# Altium project CM4_Home_Controller.PrjPcb (part 1 of 2)
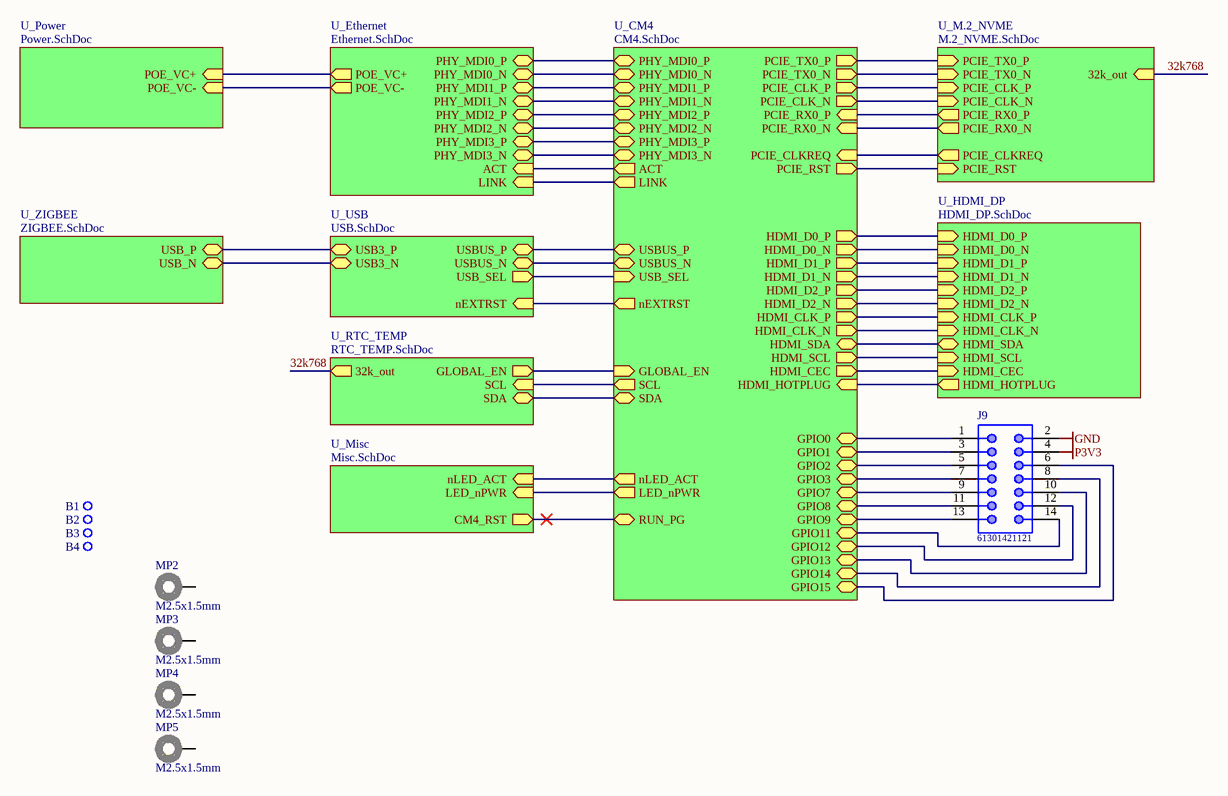
[diagram p0: CM4_Home_Controller.SchDoc]
10 sheets, 134 parts. Net scope: hierarchical (ports join the sheet entries above them; power ports are global).
Board file: CM4_Home_Controller.PcbDoc
Sheets:
  CM4_Home_Controller.SchDoc
    U_CM4 = CM4.SchDoc
    U_M.2_NVME = M.2_NVME.SchDoc
    U_Power = Power.SchDoc
    U_Ethernet = Ethernet.SchDoc
    U_USB = USB.SchDoc
    U_HDMI_DP = HDMI_DP.SchDoc
    U_RTC_TEMP = RTC_TEMP.SchDoc
    U_ZIGBEE = ZIGBEE.SchDoc
    U_Misc = Misc.SchDoc

## Sheet CM4_Home_Controller.SchDoc
size A4; SheetNumber: 1; SheetTotal: 10

### Parts
B1  Plated Hole  [MTG300_600]  (value not drawn)  (no BOM)
B2  Plated Hole  [MTG300_600]  (value not drawn)  (no BOM)
B3  Plated Hole  [MTG300_600]  (value not drawn)  (no BOM)
B4  Plated Hole  [MTG300_600]  (value not drawn)  (no BOM)
J9  61301421121  [61301421121]
MP2  M2.5x1.5mm  [9774015151]
MP3  M2.5x1.5mm  [9774015151]
MP4  M2.5x1.5mm  [9774015151]
MP5  M2.5x1.5mm  [9774015151]

### Sub-sheets
U_CM4 = CM4.SchDoc: PCIE_RX0_N (in), PCIE_RX0_P (in), PCIE_TX0_N (out), PCIE_TX0_P (out), PCIE_CLK_P (out), PCIE_CLK_N (out), PCIE_RST (out), PCIE_CLKREQ (in), PHY_MDI0_P (bidir), LINK (out), ACT (out), PHY_MDI3_N (bidir), PHY_MDI3_P (bidir), PHY_MDI2_N (bidir), PHY_MDI2_P (bidir), PHY_MDI1_N (bidir), PHY_MDI1_P (bidir), PHY_MDI0_N (bidir), USBUS_P (bidir), USBUS_N (bidir), HDMI_D0_P (out), HDMI_D0_N (out), HDMI_D1_P (out), HDMI_D1_N (out), HDMI_D2_P (out), HDMI_D2_N (out), HDMI_CLK_P (out), HDMI_CLK_N (out), HDMI_SDA (bidir), HDMI_SCL (out), HDMI_CEC (out), HDMI_HOTPLUG (in), GLOBAL_EN (in), SDA (bidir), nEXTRST (out), nLED_ACT (out), LED_nPWR (out), USB_SEL (in), SCL (out), RUN_PG (bidir), GPIO0 (bidir), GPIO12 (bidir), GPIO1 (bidir), GPIO14 (bidir), GPIO3 (bidir), GPIO11 (bidir), GPIO9 (bidir), GPIO2 (bidir), GPIO15 (bidir), GPIO13 (bidir), GPIO8 (bidir), GPIO7 (bidir)
U_Ethernet = Ethernet.SchDoc: PHY_MDI0_P (bidir), PHY_MDI0_N (bidir), PHY_MDI1_P (bidir), PHY_MDI1_N (bidir), PHY_MDI2_P (bidir), PHY_MDI2_N (bidir), PHY_MDI3_P (bidir), PHY_MDI3_N (bidir), ACT (in), LINK (in), POE_VC+ (out), POE_VC- (out)
U_HDMI_DP = HDMI_DP.SchDoc: HDMI_D1_P (in), HDMI_SCL (in), HDMI_D1_N (in), HDMI_CEC (in), HDMI_CLK_N (in), HDMI_HOTPLUG (out), HDMI_CLK_P (in), HDMI_SDA (bidir), HDMI_D2_N (in), HDMI_D0_P (in), HDMI_D0_N (in), HDMI_D2_P (in)
U_M.2_NVME = M.2_NVME.SchDoc: PCIE_RX0_N (out), PCIE_RX0_P (out), PCIE_TX0_N (in), PCIE_TX0_P (in), PCIE_CLK_P (in), PCIE_CLK_N (in), PCIE_RST (in), PCIE_CLKREQ (out), 32k_out (in)
U_Misc = Misc.SchDoc: nLED_ACT (in), LED_nPWR (in), CM4_RST (out)
U_Power = Power.SchDoc: POE_VC+ (in), POE_VC- (in)
U_RTC_TEMP = RTC_TEMP.SchDoc: 32k_out (out), GLOBAL_EN (out), SCL (in), SDA (bidir)
U_USB = USB.SchDoc: USBUS_P (bidir), USBUS_N (bidir), USB3_N (bidir), USB3_P (bidir), nEXTRST (in), USB_SEL (out)
U_ZIGBEE = ZIGBEE.SchDoc: USB_P (bidir), USB_N (bidir)

### Nets
GND: J9.2
P3V3: J9.4
32k768: sheet U_M.2_NVME/32k_out, sheet U_RTC_TEMP/32k_out
ACT: sheet U_CM4/ACT, sheet U_Ethernet/ACT
CM4_RST: sheet U_CM4/RUN_PG, sheet U_Misc/CM4_RST
GLOBAL_EN: sheet U_CM4/GLOBAL_EN, sheet U_RTC_TEMP/GLOBAL_EN
HDMI_CEC: sheet U_CM4/HDMI_CEC, sheet U_HDMI_DP/HDMI_CEC
HDMI_CLK_N: sheet U_CM4/HDMI_CLK_N, sheet U_HDMI_DP/HDMI_CLK_N
HDMI_CLK_P: sheet U_CM4/HDMI_CLK_P, sheet U_HDMI_DP/HDMI_CLK_P
HDMI_D0_N: sheet U_CM4/HDMI_D0_N, sheet U_HDMI_DP/HDMI_D0_N
HDMI_D0_P: sheet U_CM4/HDMI_D0_P, sheet U_HDMI_DP/HDMI_D0_P
HDMI_D1_N: sheet U_CM4/HDMI_D1_N, sheet U_HDMI_DP/HDMI_D1_N
HDMI_D1_P: sheet U_CM4/HDMI_D1_P, sheet U_HDMI_DP/HDMI_D1_P
HDMI_D2_N: sheet U_CM4/HDMI_D2_N, sheet U_HDMI_DP/HDMI_D2_N
HDMI_D2_P: sheet U_CM4/HDMI_D2_P, sheet U_HDMI_DP/HDMI_D2_P
HDMI_HOTPLUG: sheet U_CM4/HDMI_HOTPLUG, sheet U_HDMI_DP/HDMI_HOTPLUG
HDMI_SCL: sheet U_CM4/HDMI_SCL, sheet U_HDMI_DP/HDMI_SCL
HDMI_SDA: sheet U_CM4/HDMI_SDA, sheet U_HDMI_DP/HDMI_SDA
LED_nPWR: sheet U_CM4/LED_nPWR, sheet U_Misc/LED_nPWR
LINK: sheet U_CM4/LINK, sheet U_Ethernet/LINK
MDI0_N: sheet U_CM4/PHY_MDI0_N, sheet U_Ethernet/PHY_MDI0_N
MDI0_P: sheet U_CM4/PHY_MDI0_P, sheet U_Ethernet/PHY_MDI0_P
MDI1_N: sheet U_CM4/PHY_MDI1_N, sheet U_Ethernet/PHY_MDI1_N
MDI1_P: sheet U_CM4/PHY_MDI1_P, sheet U_Ethernet/PHY_MDI1_P
MDI2_N: sheet U_CM4/PHY_MDI2_N, sheet U_Ethernet/PHY_MDI2_N
MDI2_P: sheet U_CM4/PHY_MDI2_P, sheet U_Ethernet/PHY_MDI2_P
MDI3_N: sheet U_CM4/PHY_MDI3_N, sheet U_Ethernet/PHY_MDI3_N
MDI3_P: sheet U_CM4/PHY_MDI3_P, sheet U_Ethernet/PHY_MDI3_P
nEXTRST: sheet U_CM4/nEXTRST, sheet U_USB/nEXTRST
nLED_ACT: sheet U_CM4/nLED_ACT, sheet U_Misc/nLED_ACT
PCIE_CLK_N: sheet U_CM4/PCIE_CLK_N, sheet U_M.2_NVME/PCIE_CLK_N
PCIE_CLK_P: sheet U_CM4/PCIE_CLK_P, sheet U_M.2_NVME/PCIE_CLK_P
PCIE_CLKREQ: sheet U_CM4/PCIE_CLKREQ, sheet U_M.2_NVME/PCIE_CLKREQ
PCIE_RST: sheet U_CM4/PCIE_RST, sheet U_M.2_NVME/PCIE_RST
PCIE_RX0_N: sheet U_CM4/PCIE_RX0_N, sheet U_M.2_NVME/PCIE_RX0_N
PCIE_RX0_P: sheet U_CM4/PCIE_RX0_P, sheet U_M.2_NVME/PCIE_RX0_P
PCIE_TX0_N: sheet U_CM4/PCIE_TX0_N, sheet U_M.2_NVME/PCIE_TX0_N
PCIE_TX0_P: sheet U_CM4/PCIE_TX0_P, sheet U_M.2_NVME/PCIE_TX0_P
SCL: sheet U_CM4/SCL, sheet U_RTC_TEMP/SCL
SDA: sheet U_CM4/SDA, sheet U_RTC_TEMP/SDA
USB3_N: sheet U_USB/USB3_N, sheet U_ZIGBEE/USB_N
USB3_P: sheet U_USB/USB3_P, sheet U_ZIGBEE/USB_P
USB_SEL: sheet U_CM4/USB_SEL, sheet U_USB/USB_SEL
USBUS_N: sheet U_CM4/USBUS_N, sheet U_USB/USBUS_N
USBUS_P: sheet U_CM4/USBUS_P, sheet U_USB/USBUS_P
NetCM1_28: J9.10 ; sheet U_CM4/GPIO13
NetCM1_31: J9.12 ; sheet U_CM4/GPIO12
NetCM1_35: J9.3 ; sheet U_CM4/GPIO1
NetCM1_36: J9.1 ; sheet U_CM4/GPIO0
NetCM1_37: J9.9 ; sheet U_CM4/GPIO7
NetCM1_38: J9.14 ; sheet U_CM4/GPIO11
NetCM1_39: J9.11 ; sheet U_CM4/GPIO8
NetCM1_40: J9.13 ; sheet U_CM4/GPIO9
NetCM1_51: J9.6 ; sheet U_CM4/GPIO15
NetCM1_55: J9.8 ; sheet U_CM4/GPIO14
NetCM1_56: J9.7 ; sheet U_CM4/GPIO3
NetCM1_58: J9.5 ; sheet U_CM4/GPIO2
NetD3#2_3: sheet U_Power/POE_VC+, sheet U_Ethernet/POE_VC+
NetD3#2_4: sheet U_Power/POE_VC-, sheet U_Ethernet/POE_VC-

Not connected (* = marked no-connect by the designer): B1 1; B2 1; B3 1; B4 1; MP2 1; MP3 1; MP4 1; MP5 1

### Library data of the parts
B1-B4 = PLATED_HOLE3.0_PAD6.0: Single Terminal Socket; Part Description: Plated Through Hole: Hole Dia.=3.0mm Pad Dia.=6.0mm; Mounted: No; Part Number: PLATED_HOLE3.0_PAD6.0; Component Type: Standard (No BOM); Pin Count: 1; Family: Plated Hole; Socket: No; SMD: No; Sense: No; Status: None; ComponentHeight: 0mm; HelpURL: Undefined; Author: CERN DEM JLC; CreateDate: 26.05.2008; LatestRevisionDate: 26.05.2008; PackageDescription: Plated Through Hole: Hole Dia.=3.0mm Pad Dia.=6.0mm
J9 = 61301421121: WR-PHD Pin Header, THT, pitch 2.54mm, Dual Row, Vertical, 14pin; Pin Number: 14; Gender: Male; Rated Current: 3A; Working Voltage: 250VAC; Withstanding Voltage: 500VAC; Contact Resistance: 20mOhm; ComponentLink1Description: Manufacturer; ComponentLink1URL: http://www.we-online.de; ComponentLink2Description: Datasheet; ComponentLink2URL: https://katalog.we-online.de/em/datasheet/6130xx21121.pdf; Part Number: 61301421121; Published Date: June 2019; Publisher: Wurth Elektronik; Pitch: 2.54mm; Operating Temperature: -40 to +105degC; Mounting Technology: THT; Packaging: Bag; Row Number: Dual; Orientation: Vertical
MP2-MP5 = 9774015151: WA-SMSI SMT Steel Spacer, internal Thread, OD 5.1mm, M2.5x1.5mm; Manufacturer: Wurth Elektronik; Inner Diameter: 3.5mm; Surface: Tin; Thread: M2.5; ComponentLink1Description: Manufacturer; ComponentLink1URL: http://www.we-online.de; ComponentLink2Description: Datasheet; ComponentLink2URL: https://www.we-online.com/catalog/datasheet/9774015151.pdf; Mounting Technology: SMT; Packaging: Bulk; Manufacturer Part Number: 9774015151; Length: 1.5mm; Inner Thread Length: -; Operating Temperature: -55 to +150degC; Outer Diameter: 5.1mm; Published Date: April 2020; Material: Steel

## Sheet CM4.SchDoc
size A3; SheetNumber: 3; SheetTotal: 10
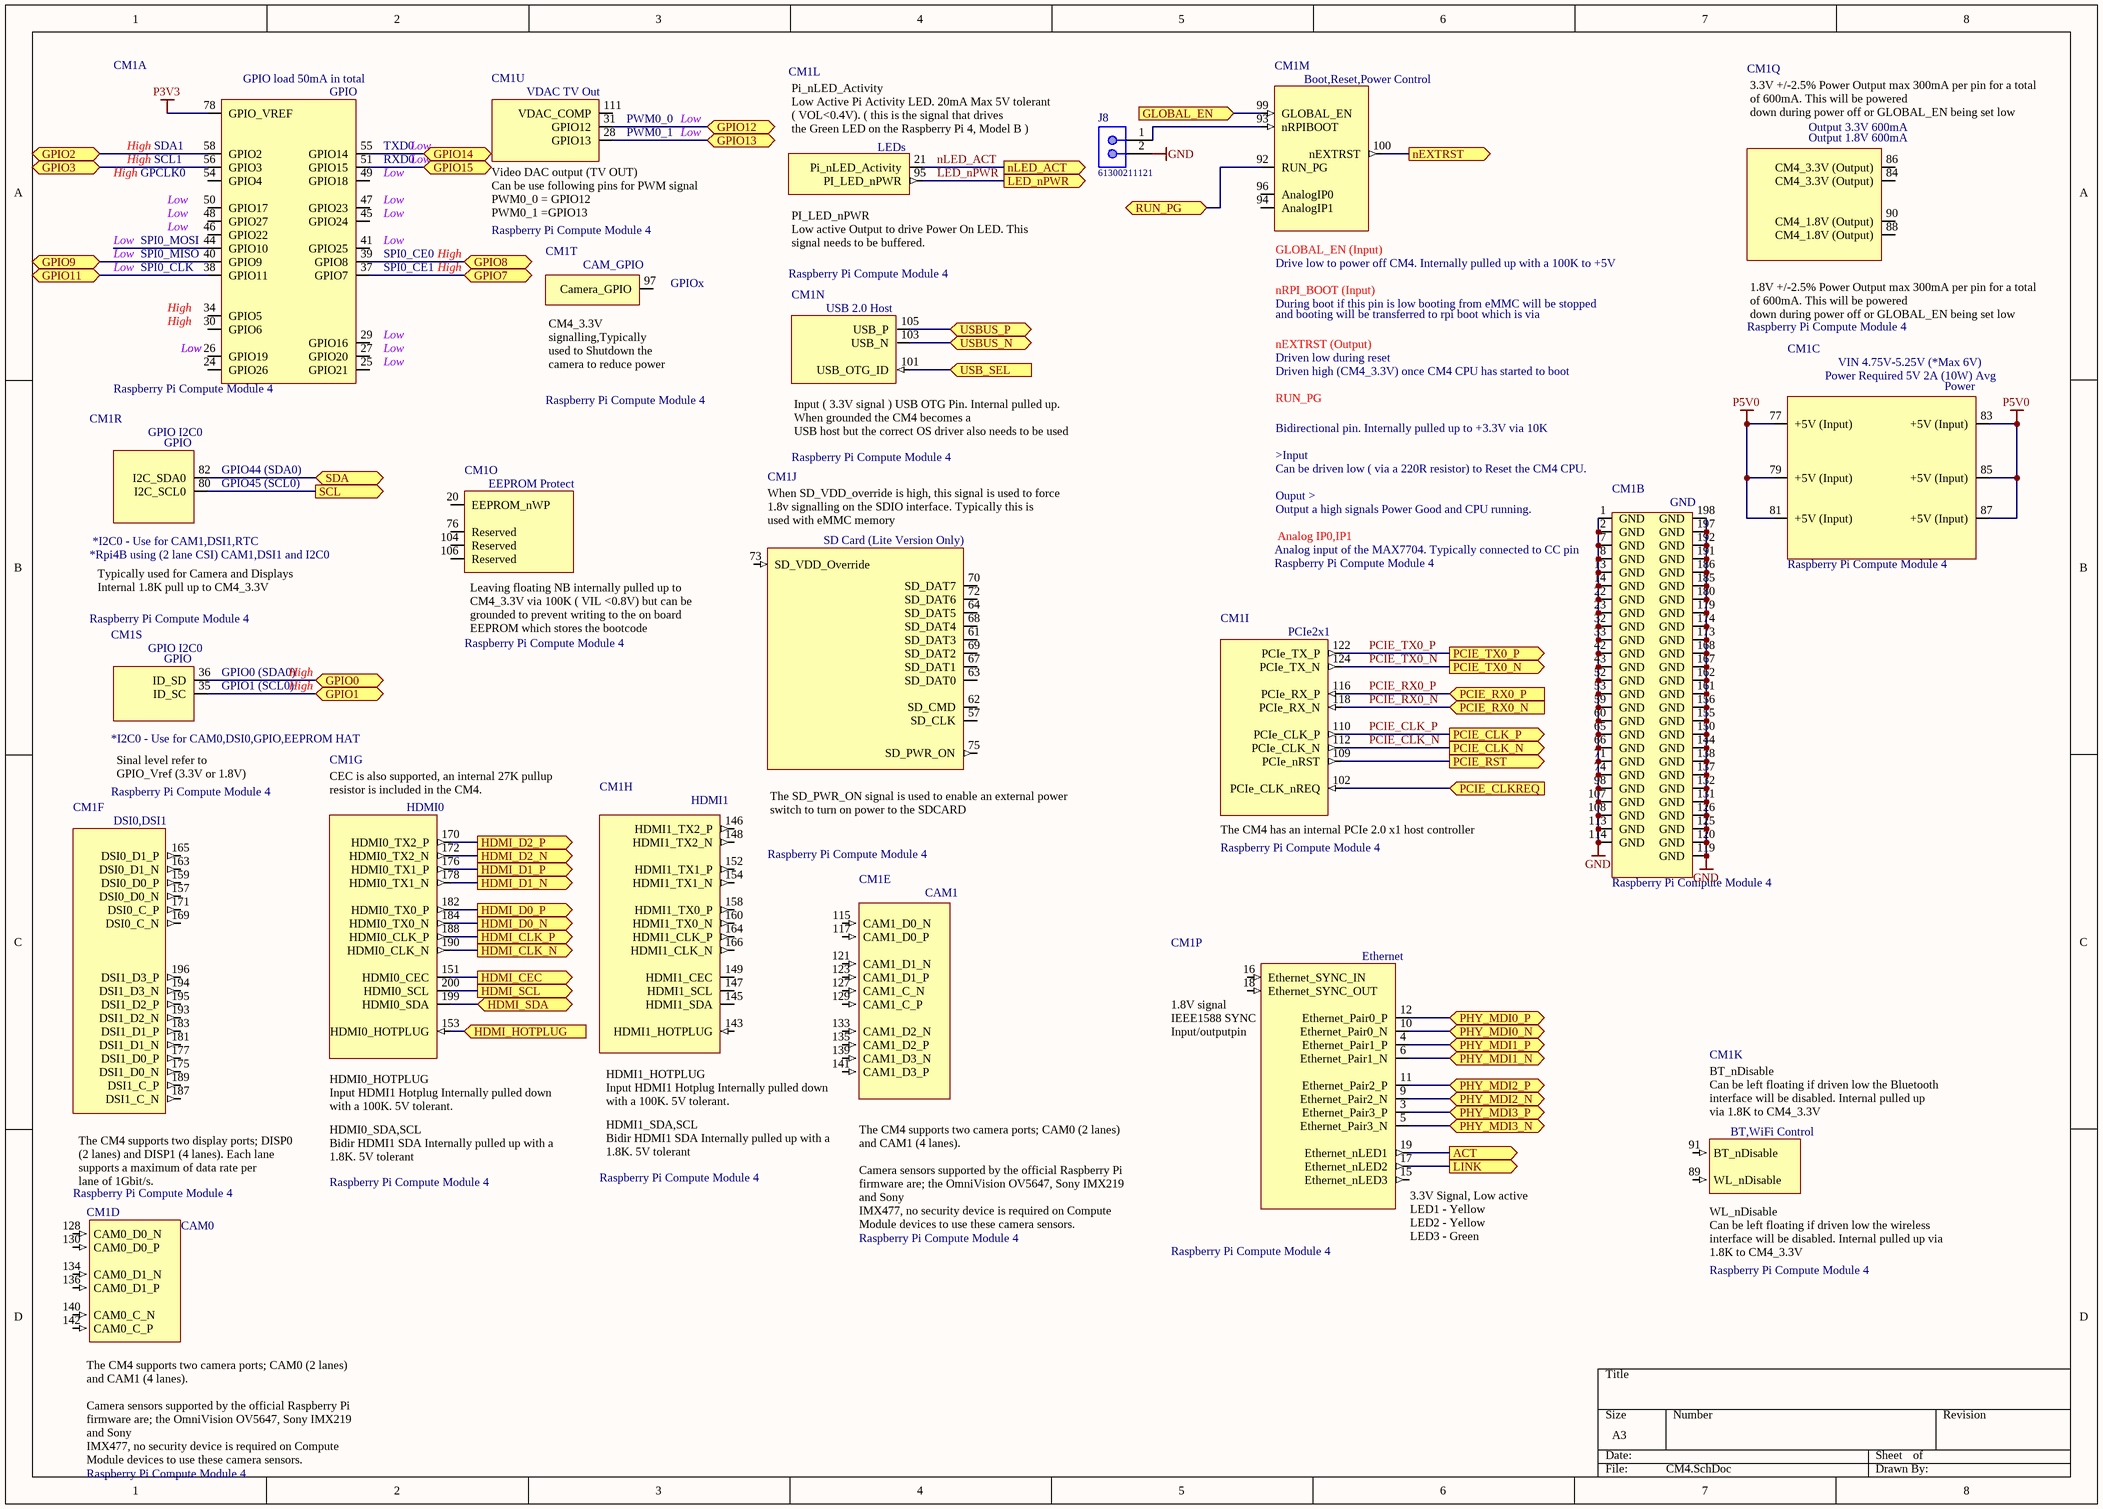
[diagram p1: CM4.SchDoc]

### Parts
CM1  Raspberry Pi Compute Module 4  [CM4-DF40HC(3.0)-100DS-0.4v_3mm_1.5mm]  (parts A,B,C,D,E,F,G,H,I,J,K,L,M,N,O,P,Q,R,S,T,U of 21)  (no BOM)
J8  61300211121  [61300211121]

### Ports
ACT (out), GLOBAL_EN (in), GPIO0 (bidir), GPIO1 (bidir), GPIO2 (bidir), GPIO3 (bidir), GPIO7 (bidir), GPIO8 (bidir), GPIO9 (bidir), GPIO11 (bidir), GPIO12 (bidir), GPIO13 (bidir), GPIO14 (bidir), GPIO15 (bidir), HDMI_CEC (out), HDMI_CLK_N (out), HDMI_CLK_P (out), HDMI_D0_N (out), HDMI_D0_P (out), HDMI_D1_N (out), HDMI_D1_P (out), HDMI_D2_N (out), HDMI_D2_P (out), HDMI_HOTPLUG (in), HDMI_SCL (out), HDMI_SDA (bidir), LED_nPWR (out), LINK (out), nEXTRST (out), nLED_ACT (out), PCIE_CLK_N (out), PCIE_CLK_P (out), PCIE_CLKREQ (in), PCIE_RST (out), PCIE_RX0_N (in), PCIE_RX0_P (in), PCIE_TX0_N (out), PCIE_TX0_P (out), PHY_MDI0_N (bidir), PHY_MDI0_P (bidir), PHY_MDI1_N (bidir), PHY_MDI1_P (bidir), PHY_MDI2_N (bidir), PHY_MDI2_P (bidir), PHY_MDI3_N (bidir), PHY_MDI3_P (bidir), RUN_PG (bidir), SCL (out), SDA (bidir), USB_SEL (in), USBUS_N (bidir), USBUS_P (bidir)

### Nets
GND: CM1.1(GND) CM1.2(GND) CM1.7(GND) CM1.8(GND) CM1.13(GND) CM1.14(GND) CM1.22(GND) CM1.23(GND) CM1.32(GND) CM1.33(GND) CM1.42(GND) CM1.43(GND) CM1.52(GND) CM1.53(GND) CM1.59(GND) CM1.60(GND) CM1.65(GND) CM1.66(GND) CM1.71(GND) CM1.74(GND) CM1.98(GND) CM1.107(GND) CM1.108(GND) CM1.113(GND) CM1.114(GND) CM1.119(GND) CM1.120(GND) CM1.125(GND) CM1.126(GND) CM1.131(GND) CM1.132(GND) CM1.137(GND) CM1.138(GND) CM1.144(GND) CM1.150(GND) CM1.155(GND) CM1.156(GND) CM1.161(GND) CM1.162(GND) CM1.167(GND) CM1.168(GND) CM1.173(GND) CM1.174(GND) CM1.179(GND) CM1.180(GND) CM1.185(GND) CM1.186(GND) CM1.191(GND) CM1.192(GND) CM1.197(GND) CM1.198(GND) J8.2
P3V3: CM1.78(GPIO_VREF)
P5V0: CM1.77(+5V_(Input)) CM1.79(+5V_(Input)) CM1.81(+5V_(Input)) CM1.83(+5V_(Input)) CM1.85(+5V_(Input)) CM1.87(+5V_(Input))
ACT: CM1.19(Ethernet_nLED1) ; port ACT
CM4_RST: CM1.92(RUN_PG) ; port RUN_PG
GLOBAL_EN: CM1.99(GLOBAL_EN) ; port GLOBAL_EN
HDMI_CEC: CM1.151(HDMI0_CEC) ; port HDMI_CEC
HDMI_CLK_N: CM1.190(HDMI0_CLK_N) ; port HDMI_CLK_N
HDMI_CLK_P: CM1.188(HDMI0_CLK_P) ; port HDMI_CLK_P
HDMI_D0_N: CM1.184(HDMI0_TX0_N) ; port HDMI_D0_N
HDMI_D0_P: CM1.182(HDMI0_TX0_P) ; port HDMI_D0_P
HDMI_D1_N: CM1.178(HDMI0_TX1_N) ; port HDMI_D1_N
HDMI_D1_P: CM1.176(HDMI0_TX1_P) ; port HDMI_D1_P
HDMI_D2_N: CM1.172(HDMI0_TX2_N) ; port HDMI_D2_N
HDMI_D2_P: CM1.170(HDMI0_TX2_P) ; port HDMI_D2_P
HDMI_HOTPLUG: CM1.153(HDMI0_HOTPLUG) ; port HDMI_HOTPLUG
HDMI_SCL: CM1.200(HDMI0_SCL) ; port HDMI_SCL
HDMI_SDA: CM1.199(HDMI0_SDA) ; port HDMI_SDA
LED_nPWR: CM1.95(PI_LED_nPWR) ; port LED_nPWR
LINK: CM1.17(Ethernet_nLED2) ; port LINK
MDI0_N: CM1.10(Ethernet_Pair0_N) ; port PHY_MDI0_N
MDI0_P: CM1.12(Ethernet_Pair0_P) ; port PHY_MDI0_P
MDI1_N: CM1.6(Ethernet_Pair1_N) ; port PHY_MDI1_N
MDI1_P: CM1.4(Ethernet_Pair1_P) ; port PHY_MDI1_P
MDI2_N: CM1.9(Ethernet_Pair2_N) ; port PHY_MDI2_N
MDI2_P: CM1.11(Ethernet_Pair2_P) ; port PHY_MDI2_P
MDI3_N: CM1.5(Ethernet_Pair3_N) ; port PHY_MDI3_N
MDI3_P: CM1.3(Ethernet_Pair3_P) ; port PHY_MDI3_P
nEXTRST: CM1.100(nEXTRST) ; port nEXTRST
nLED_ACT: CM1.21(Pi_nLED_Activity) ; port nLED_ACT
PCIE_CLK_N: CM1.112(PCIe_CLK_N) ; port PCIE_CLK_N
PCIE_CLK_P: CM1.110(PCIe_CLK_P) ; port PCIE_CLK_P
PCIE_CLKREQ: CM1.102(PCIe_CLK_nREQ) ; port PCIE_CLKREQ
PCIE_RST: CM1.109(PCIe_nRST) ; port PCIE_RST
PCIE_RX0_N: CM1.118(PCIe_RX_N) ; port PCIE_RX0_N
PCIE_RX0_P: CM1.116(PCIe_RX_P) ; port PCIE_RX0_P
PCIE_TX0_N: CM1.124(PCIe_TX_N) ; port PCIE_TX0_N
PCIE_TX0_P: CM1.122(PCIe_TX_P) ; port PCIE_TX0_P
SCL: CM1.80(I2C_SCL0) ; port SCL
SDA: CM1.82(I2C_SDA0) ; port SDA
USB_SEL: CM1.101(USB_OTG_ID) ; port USB_SEL
USBUS_N: CM1.103(USB_N) ; port USBUS_N
USBUS_P: CM1.105(USB_P) ; port USBUS_P
NetCM1_28: CM1.28(GPIO13) ; port GPIO13
NetCM1_31: CM1.31(GPIO12) ; port GPIO12
NetCM1_35: CM1.35(ID_SC) ; port GPIO1
NetCM1_36: CM1.36(ID_SD) ; port GPIO0
NetCM1_37: CM1.37(GPIO7) ; port GPIO7
NetCM1_38: CM1.38(GPIO11) ; port GPIO11
NetCM1_39: CM1.39(GPIO8) ; port GPIO8
NetCM1_40: CM1.40(GPIO9) ; port GPIO9
NetCM1_51: CM1.51(GPIO15) ; port GPIO15
NetCM1_55: CM1.55(GPIO14) ; port GPIO14
NetCM1_56: CM1.56(GPIO3) ; port GPIO3
NetCM1_58: CM1.58(GPIO2) ; port GPIO2
NetCM1_93: CM1.93(nRPIBOOT) J8.1

Not connected (* = marked no-connect by the designer): CM1 15(Ethernet_nLED3) 16(Ethernet_SYNC_IN) 18(Ethernet_SYNC_OUT) 20(EEPROM_nWP) 24(GPIO26) 25(GPIO21) 26(GPIO19) 27(GPIO20) 29(GPIO16) 30(GPIO6) 34(GPIO5) 41(GPIO25) 44(GPIO10) 45(GPIO24) 46(GPIO22) 47(GPIO23) 48(GPIO27) 49(GPIO18) 50(GPIO17) 54(GPIO4) 57(SD_CLK) 61(SD_DAT3) 62(SD_CMD) 63(SD_DAT0) 64(SD_DAT5) 67(SD_DAT1) 68(SD_DAT4) 69(SD_DAT2) 70(SD_DAT7) 72(SD_DAT6) 73(SD_VDD_Override) 75(SD_PWR_ON) 76(Reserved) 84(CM4_3.3V_(Output)) 86(CM4_3.3V_(Output)) 88(CM4_1.8V_(Output)) 89(WL_nDisable) 90(CM4_1.8V_(Output)) 91(BT_nDisable) 94(AnalogIP1) 96(AnalogIP0) 97(Camera_GPIO) 104(Reserved) 106(Reserved) 111(VDAC_COMP) 115(CAM1_D0_N) 117(CAM1_D0_P) 121(CAM1_D1_N) 123(CAM1_D1_P) 127(CAM1_C_N) 128(CAM0_D0_N) 129(CAM1_C_P) 130(CAM0_D0_P) 133(CAM1_D2_N) 134(CAM0_D1_N) 135(CAM1_D2_P) 136(CAM0_D1_P) 139(CAM1_D3_N) 140(CAM0_C_N) 141(CAM1_D3_P) 142(CAM0_C_P) 143(HDMI1_HOTPLUG) 145(HDMI1_SDA) 146(HDMI1_TX2_P) 147(HDMI1_SCL) 148(HDMI1_TX2_N) 149(HDMI1_CEC) 152(HDMI1_TX1_P) 154(HDMI1_TX1_N) 157(DSI0_D0_N) 158(HDMI1_TX0_P) 159(DSI0_D0_P) 160(HDMI1_TX0_N) 163(DSI0_D1_N) 164(HDMI1_CLK_P) 165(DSI0_D1_P) 166(HDMI1_CLK_N) 169(DSI0_C_N) 171(DSI0_C_P) 175(DSI1_D0_N) 177(DSI1_D0_P) 181(DSI1_D1_N) 183(DSI1_D1_P) 187(DSI1_C_N) 189(DSI1_C_P) 193(DSI1_D2_N) 194(DSI1_D3_N) 195(DSI1_D2_P) 196(DSI1_D3_P)

### Notes on the sheet
- (in symbol CM4, part A) GPIO load 50mA in total; GPIO; High; SDA1; TXD0; Low; SCL1; RXD0; GPCLK0; SPI0_MOSI; SPI0_MISO; SPI0_CE0; SPI0_CLK; SPI0_CE1; by Amornthep Phunsin
- (in symbol CM4, part C) VIN 4.75V-5.25V (*Max 6V); Power Required 5V 2A (10W) Avg; Power; by Amornthep Phunsin
- (in symbol CM4, part D) CAM0; The CM4 supports two camera ports; CAM0 (2 lanes) and CAM1 (4 lanes). / Camera sensors supported by the official Raspberry Pi firmware are; the OmniVision OV5647, Sony IMX219 and Sony / IMX477, no security device is required on Compute Module devices to use these camera sensors.
- (in symbol CM4, part E) CAM1; The CM4 supports two camera ports; CAM0 (2 lanes) and CAM1 (4 lanes). / Camera sensors supported by the official Raspberry Pi firmware are; the OmniVision OV5647, Sony IMX219 and Sony / IMX477, no security device is required on Compute Module devices to use these camera sensors.
- (in symbol CM4, part F) DSI0,DSI1; The CM4 supports two display ports; DISP0 (2 lanes) and DISP1 (4 lanes). Each lane supports a maximum of data rate per / lane of 1Gbit/s.
- (in symbol CM4, part G) HDMI0; CEC is also supported, an internal 27K pullup resistor is included in the CM4.; HDMI0_HOTPLUG / Input HDMI1 Hotplug Internally pulled down with a 100K. 5V tolerant.; HDMI0_SDA,SCL / Bidir HDMI1 SDA Internally pulled up with a 1.8K. 5V tolerant
- (in symbol CM4, part H) HDMI1; HDMI1_HOTPLUG / Input HDMI1 Hotplug Internally pulled down with a 100K. 5V tolerant.; HDMI1_SDA,SCL / Bidir HDMI1 SDA Internally pulled up with a 1.8K. 5V tolerant
- (in symbol CM4, part I) PCIe2x1; The CM4 has an internal PCIe 2.0 x1 host controller
- (in symbol CM4, part J) When SD_VDD_override is high, this signal is used to force 1.8v signalling on the SDIO interface. Typically this is / used with eMMC memory; SD Card (Lite Version Only); by Amornthep Phunsin; The SD_PWR_ON signal is used to enable an external power switch to turn on power to the SDCARD
- (in symbol CM4, part K) BT_nDisable / Can be left floating if driven low the Bluetooth interface will be disabled. Internal pulled up / via 1.8K to CM4_3.3V; BT,WiFi Control; WL_nDisable / Can be left floating if driven low the wireless interface will be disabled. Internal pulled up via / 1.8K to CM4_3.3V
- (in symbol CM4, part L) Pi_nLED_Activity / Low Active Pi Activity LED. 20mA Max 5V tolerant ( VOL<0.4V). ( this is the signal that drives / the Green LED on the Raspberry Pi 4, Model B ); LEDs; PI_LED_nPWR / Low active Output to drive Power On LED. This signal needs to be buffered.
- (in symbol CM4, part M) Boot,Reset,Power Control; GLOBAL_EN (Input); Drive low to power off CM4. Internally pulled up with a 100K to +5V; nRPI_BOOT (Input); During boot if this pin is low booting from eMMC will be stopped; and booting will be transferred to rpi boot which is via; nEXTRST (Output); Driven low during reset; Driven high (CM4_3.3V) once CM4 CPU has started to boot; Bidirectional pin. Internally pulled up to +3.3V via 10K / >Input / Can be driven low ( via a 220R resistor) to Reset the CM4 CPU. / Ouput > / Output a high signals Power Good and CPU running.; Analog IP0,IP1; Analog input of the MAX7704. Typically connected to CC pin
- (in symbol CM4, part N) USB 2.0 Host; Input ( 3.3V signal ) USB OTG Pin. Internal pulled up. When grounded the CM4 becomes a / USB host but the correct OS driver also needs to be used
- (in symbol CM4, part O) EEPROM Protect; Leaving floating NB internally pulled up to CM4_3.3V via 100K ( VIL <0.8V) but can be / grounded to prevent writing to the on board EEPROM which stores the bootcode
- (in symbol CM4, part P) Ethernet; 1.8V signal / IEEE1588 SYNC Input/outputpin; by Amornthep Phunsin; 3.3V Signal, Low active / LED1 - Yellow / LED2 - Yellow / LED3 - Green
- (in symbol CM4, part Q) 3.3V +/-2.5% Power Output max 300mA per pin for a total of 600mA. This will be powered / down during power off or GLOBAL_EN being set low; Output 3.3V 600mA; Output 1.8V 600mA; 1.8V +/-2.5% Power Output max 300mA per pin for a total of 600mA. This will be powered / down during power off or GLOBAL_EN being set low
- (in symbol CM4, part R) GPIO I2C0; GPIO; GPIO44 (SDA0); GPIO45 (SCL0); *I2C0 - Use for CAM1,DSI1,RTC; *Rpi4B using (2 lane CSI) CAM1,DSI1 and I2C0; Typically used for Camera and Displays Internal 1.8K pull up to CM4_3.3V
- (in symbol CM4, part S) GPIO I2C0; GPIO; GPIO0 (SDA0); High; GPIO1 (SCL0); *I2C0 - Use for CAM0,DSI0,GPIO,EEPROM HAT; Sinal level refer to  GPIO_Vref (3.3V or 1.8V)
- (in symbol CM4, part T) CAM_GPIO; GPIOx; CM4_3.3V signalling,Typically used to Shutdown the camera to reduce power
- (in symbol CM4, part U) VDAC TV Out; PWM0_0; Low; PWM0_1; Video DAC output (TV OUT) / Can be use following pins for PWM signal / PWM0_0 = GPIO12 / PWM0_1 =GPIO13

### Library data of the parts
CM1 = CM4: Raspberry Pi Compute Module 4 by Amornthep Phunsin
J8 = 61300211121: WR-PHD Pin Header, THT, pitch 2.54mm, Single Row, Vertical, 2pin; Pin Number: 2; Gender: Male; Rated Current: 3A; Working Voltage: 250VAC; Withstanding Voltage: 500VAC; Contact Resistance: 20mOhm; ComponentLink1Description: Manufacturer; ComponentLink1URL: http://www.we-online.de; ComponentLink2Description: Datasheet; ComponentLink2URL: https://katalog.we-online.de/em/datasheet/6130xx11121.pdf; Part Number: 61300211121; Published Date: June 2019; Publisher: Wurth Elektronik; Pitch: 2.54mm; Operating Temperature: -40 to +105degC; Mounting Technology: THT; Packaging: Bag; Row Number: Single; Orientation: Vertical

## Sheet M.2_NVME.SchDoc
size A3; SheetNumber: 2; SheetTotal: 10
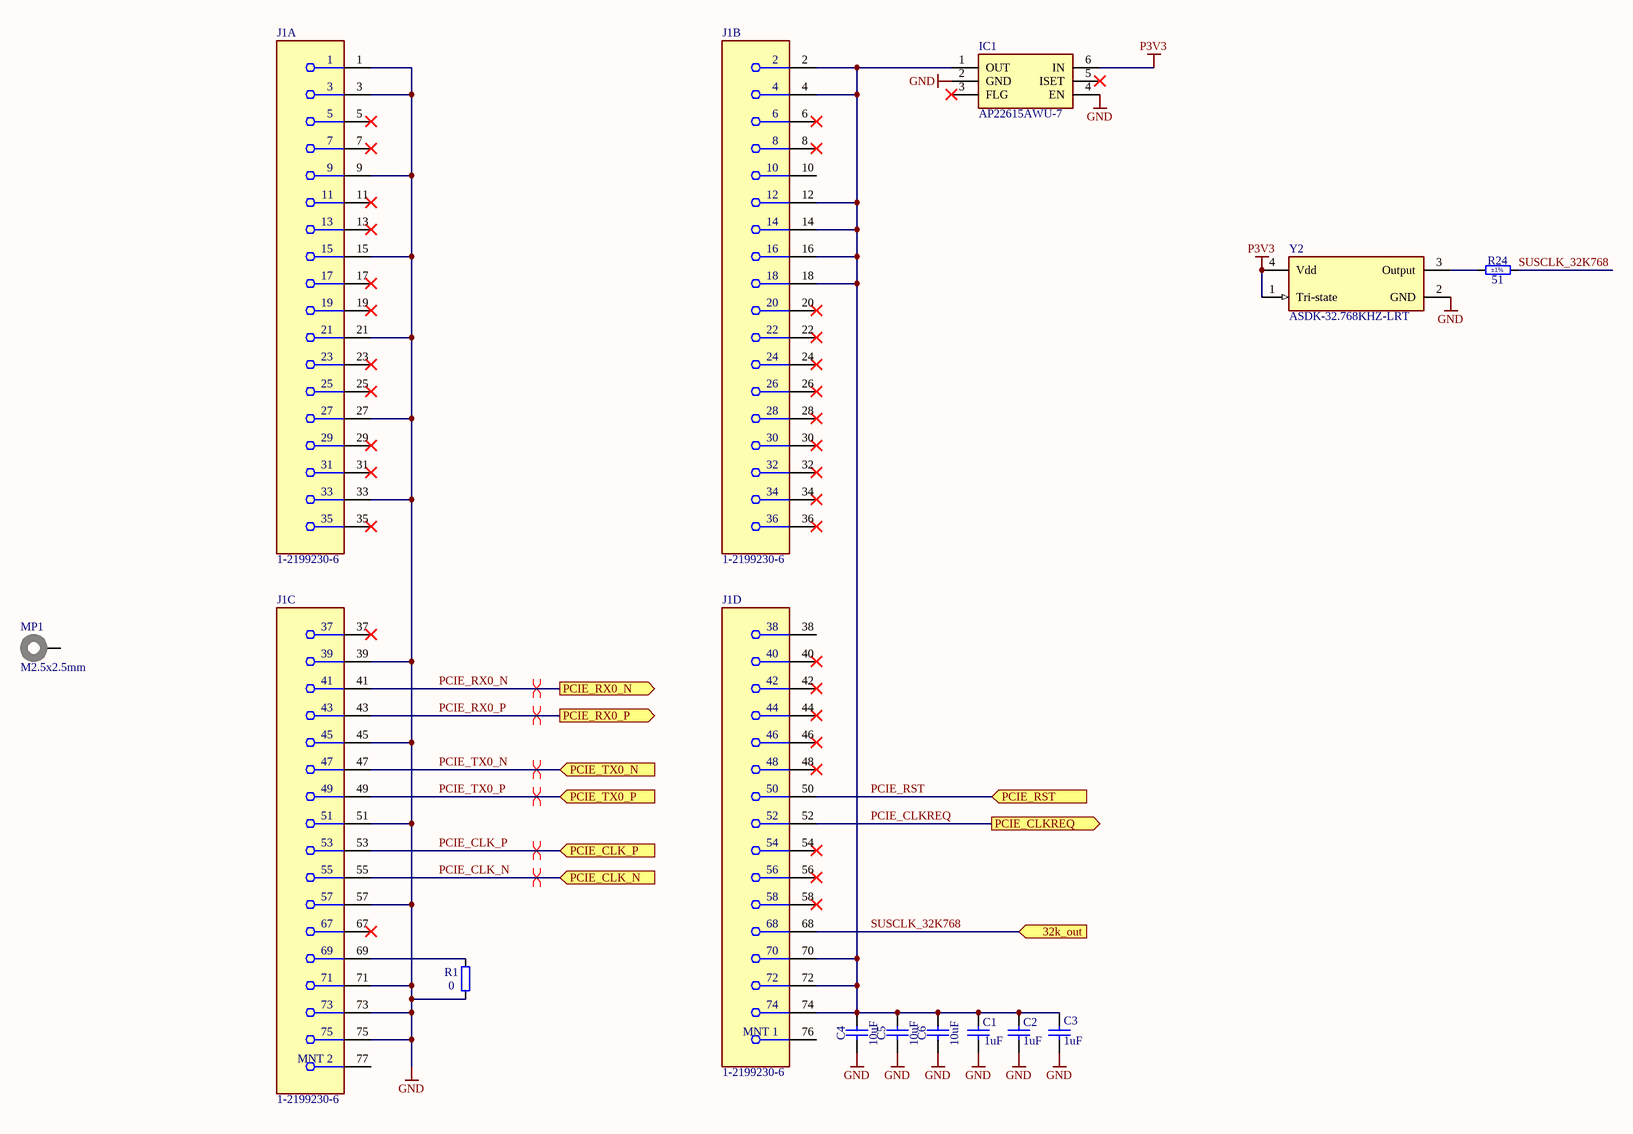
[diagram p2: M.2_NVME.SchDoc]

### Parts
C1  1uF  [CAPC1005X55N]
C2  1uF  [CAPC1005X55N]
C3  1uF  [CAPC1005X55N]
C4  10uF  [CAPC2012X95N]
C5  10uF  [CAPC2012X95N]
C6  10uF  [CAPC2012X95N]
IC1  AP22615AWU-7  [SOT95P280X100-6N]
J1  1-2199230-6  [FP-1-2199230-6-MFG]  (parts A,B,C,D of 4)
MP1  M2.5x2.5mm  [9774025151]
R1  0  [RESC1005X40N]
R24  51  Tolerance: ±1%  [RESC1005X40N]
Y2  ASDK-32.768KHZ-LRT  [FP-ASDK-MFG]

### Ports
32k_out (in), PCIE_CLK_N (in), PCIE_CLK_P (in), PCIE_CLKREQ (out), PCIE_RST (in), PCIE_RX0_N (out), PCIE_RX0_P (out), PCIE_TX0_N (in), PCIE_TX0_P (in)

### Nets
GND: C1.1 C2.1 C3.1 C4.1 C5.1 C6.1 IC1.2(GND) IC1.4(EN) J1.1 J1.3 J1.9 J1.15 J1.21 J1.27 J1.33 J1.39 J1.45 J1.51 J1.57 J1.71 J1.73 J1.75 R1.1 Y2.2(GND)
P3V3: IC1.6(IN) Y2.1(Tri-state) Y2.4(Vdd)
PCIE_CLK_N: J1.55 ; port PCIE_CLK_N
PCIE_CLK_P: J1.53 ; port PCIE_CLK_P
PCIE_CLKREQ: J1.52 ; port PCIE_CLKREQ
PCIE_RST: J1.50 ; port PCIE_RST
PCIE_RX0_N: J1.41 ; port PCIE_RX0_N
PCIE_RX0_P: J1.43 ; port PCIE_RX0_P
PCIE_TX0_N: J1.47 ; port PCIE_TX0_N
PCIE_TX0_P: J1.49 ; port PCIE_TX0_P
SUSCLK_32K768: J1.68 R24.2 ; port 32k_out  [project net 32k768]
NetC1_2: C1.2 C2.2 C3.2 C4.2 C5.2 C6.2 IC1.1(OUT) J1.2 J1.4 J1.12 J1.14 J1.16 J1.18 J1.70 J1.72 J1.74
NetJ1_69: J1.69 R1.2
NetR24_1: R24.1 Y2.3(Output)

Not connected (* = marked no-connect by the designer): IC1 3(FLG)* 5(ISET)*; J1 5* 6* 7* 8* 10 11* 13* 17* 19* 20* 22* 23* 24* 25* 26* 28* 29* 30* 31* 32* 34* 35* 36* 37* 38 40* 42* 44* 46* 48* 54* 56* 58* 67* 76(MNT_1) 77(MNT_2); MP1 1

### Layout directives
differential pair: PCIE_CLK_N, PCIE_CLK_P, PCIE_RX0_N, PCIE_RX0_P, PCIE_TX0_N, PCIE_TX0_P

### Library data of the parts
C1-C3 = CC0402_1UF_16V_10%_X5R: Non-polarised capacitor; Part Description: SMD Multilayer Chip Ceramic Capacitor; Manufacturer: GENERIC; Manufacturer1 Part Number: C1005X5R1C105KT; Voltage: 16V; TC: X5R; Tolerance: ±10%; Part Number: CC0402_1UF_16V_10%_X5R; Component Kind: Standard; Component Type: Standard; Pin Count: 2; Value: 1uF; Status: Preferred; Manufacturer Part Number: CC0402_1UF_16V_10%_X5R; Case: 0402; Mounted: Yes; Socket: No; SMD: Yes; Sense: No; Manufacturer1 Example: TDK; Manufacturer1 ComponentHeight: 0.55mm; HelpURL: \\cern.ch\dfs\Applications\Altium\Datasheets\CC0402_X5R_TDK_C.pdf; Author: CERN DEM JLC; CreateDate: 2012-10-25; LatestRevisionDate: 2012-10-25
C4-C6 = CC0805_10UF_25V_10%_X5R: Non-polarised capacitor; Part Description: SMD Multilayer Chip Ceramic Capacitor; Manufacturer: GENERIC; Manufacturer1 Part Number: GRM219R61E106KA12D; Voltage: 25V; TC: X5R; Tolerance: ±10%; Part Number: CC0805_10UF_25V_10%_X5R; Component Kind: Standard; Component Type: Standard; Pin Count: 2; Value: 10uF; Status: Preferred; Manufacturer Part Number: CC0805_10UF_25V_10%_X5R; Case: 0805; Mounted: Yes; Socket: No; SMD: Yes; Sense: No; Manufacturer1 Example: MURATA; Manufacturer1 ComponentHeight: 0.95mm; HelpURL: \\cern.ch\dfs\Applications\Altium\Datasheets\CC0805_X5R_MURATA_GRM.pdf; Author: CERN DEM JLC; CreateDate: 25.10.2012; LatestRevisionDate: 06.09.2016
IC1 = AP22615AWU-7: Integrated Circuit; Manufacturer_Name: Diodes Inc.; Datasheet Link: https://www.diodes.com/assets/Datasheets/AP22815-615.pdf; Height: 1mm; Manufacturer_Part_Number: AP22615AWU-7
J1 = CMP-03365-000001-1: CONN EDGE DUAL FMALE 67POS 0.020; Manufacturer: TE; Number Of Contacts: 67; Current Rating: 0.5A; Pitch: 0.5mm; Conn Gender: Female; Is Female: yes; Voltage Rating: 50V; Conn Orientation: Right Angle; Automotive: No; Temperature Range High: +80°C; Package: 1-2199230-6; Category: Conn; Temperature: -40°C to +80°C; Number Of Rows: 2; ComponentLink2URL: http://www.te.com/commerce/DocumentDelivery/DDEController?Action=showdoc&DocId=Specification+Or+Standard%7F114-115006%7FB%7Fpdf%7FEnglish%7FENG_SS_114-115006_B_114-115006_REV_B.pdf%7F1-2199230-6; Manufacturer Part Number: 1-2199230-6; Height: 4.2mm; RoHS: TRUE; Footprint Url: http://www.te.com/commerce/DocumentDelivery/DDEController?Action=showdoc&DocId=Customer+Drawing%7F2199230%7FB2%7Fpdf%7FEnglish%7FENG_CD_2199230_B2.pdf%7F1-2199230-6; Digikey Description: CONN EDGE DUAL FMALE 67POS 0.020; Device Class L2: Card Edge Connectors; Contact Material: Gold,Tin; Device Class L1: Connectors; Device Class L3: unset; ComponentLink2Description: Datasheet; Temperature Range Low: -40°C; Octopart: https://octopart.com/1-2199230-6-te+connectivity-34969376; Lead Free: Yes
MP1 = 9774025151: WA-SMSI SMT Steel Spacer, internal Thread, OD 5.1mm, M2.5x2.5mm; Manufacturer: Wurth Elektronik; Inner Diameter: 3.5mm; Surface: Tin; Thread: M2.5; ComponentLink1Description: Manufacturer; ComponentLink1URL: http://www.we-online.de; ComponentLink2Description: Datasheet; ComponentLink2URL: https://www.we-online.com/catalog/datasheet/9774025151.pdf; Mounting Technology: SMT; Packaging: Bulk; Manufacturer Part Number: 9774025151; Length: 2.5mm; Inner Thread Length: -; Operating Temperature: -55 to +150degC; Outer Diameter: 5.1mm; Published Date: April 2020; Material: Steel
R1 = R0402_0R_JUMPER: Resistor; Part Description: 1A (0.05R Max DC Resistance) Zero Ohm Jumper; Manufacturer: GENERIC; Manufacturer1 Part Number: 232270591001L; PressFit: No; Part Number: R0402_0R_JUMPER; Component Kind: Standard; Component Type: Standard; Pin Count: 2; Value: 0; Status: Not Recommended; Manufacturer Part Number: R0402_0R_JUMPER; Case: 0402; Mounted: Yes; Sense: No; Socket: No; SMD: Yes; Manufacturer1 Example: YAGEO PHYCOMP; Manufacturer1 ComponentHeight: 0.4mm; HelpURL: \\cern.ch\dfs\Applications\Altium\Datasheets\R0402_Phycomp_RC0402.pdf; Author: CERN DEM JLC; CreateDate: 03.12.2007; LatestRevisionDate: 17.10.2012
R24 = R0402_51R_1%_0.0625W_100PPM: Resistor - 1%; Part Description: General Purpose Thick Film Chip Resistor; Manufacturer: GENERIC; Manufacturer1 Part Number: 232270675109L; TC: ±100ppm/°C; PressFit: No; Part Number: R0402_51R_1%_0.0625W_100PPM; Component Kind: Standard; Component Type: Standard; Pin Count: 2; Value: 51; Status: Not Recommended; Power: 0.0625W; Manufacturer Part Number: R0402_51R_1%_0.0625W_100PPM; Case: 0402; Mounted: Yes; Sense: No; Socket: No; SMD: Yes; Manufacturer1 Example: YAGEO PHYCOMP; Manufacturer1 ComponentHeight: 0.4mm; HelpURL: \\cern.ch\dfs\Applications\Altium\Datasheets\R0402_Phycomp_RC0402.pdf; Author: CERN DEM JLC; CreateDate: 03.12.2007; LatestRevisionDate: 17.10.2012
Y2 = CMP-27762-001115-1: XTAL OSC XO 32.7680KHZ CMOS SMD; Load Capacitance: 15pF; Max Supply Current: 3.5mA; Min Supply Voltage: 2.97V; Operating Supply Voltage: 3.3V; Frequency Stability: 25ppm; Lead Free: Lead Free; Case/Package: CSMD; Number of Pins: 4; Max Operating Temperature: 85°C; Packaging: Tape and Reel; Width: 0.079inch; Min Operating Temperature: -40°C; Radiation Hardening: No; Length: 2.5mm; Depth: 2mm; Termination: SMD/SMT; Height: 0.037inch; Series: ASDK; Frequency: 32.768kHz; Mount: Surface Mount

## Sheet Power.SchDoc
size A4; SheetNumber: 4; SheetTotal: 10
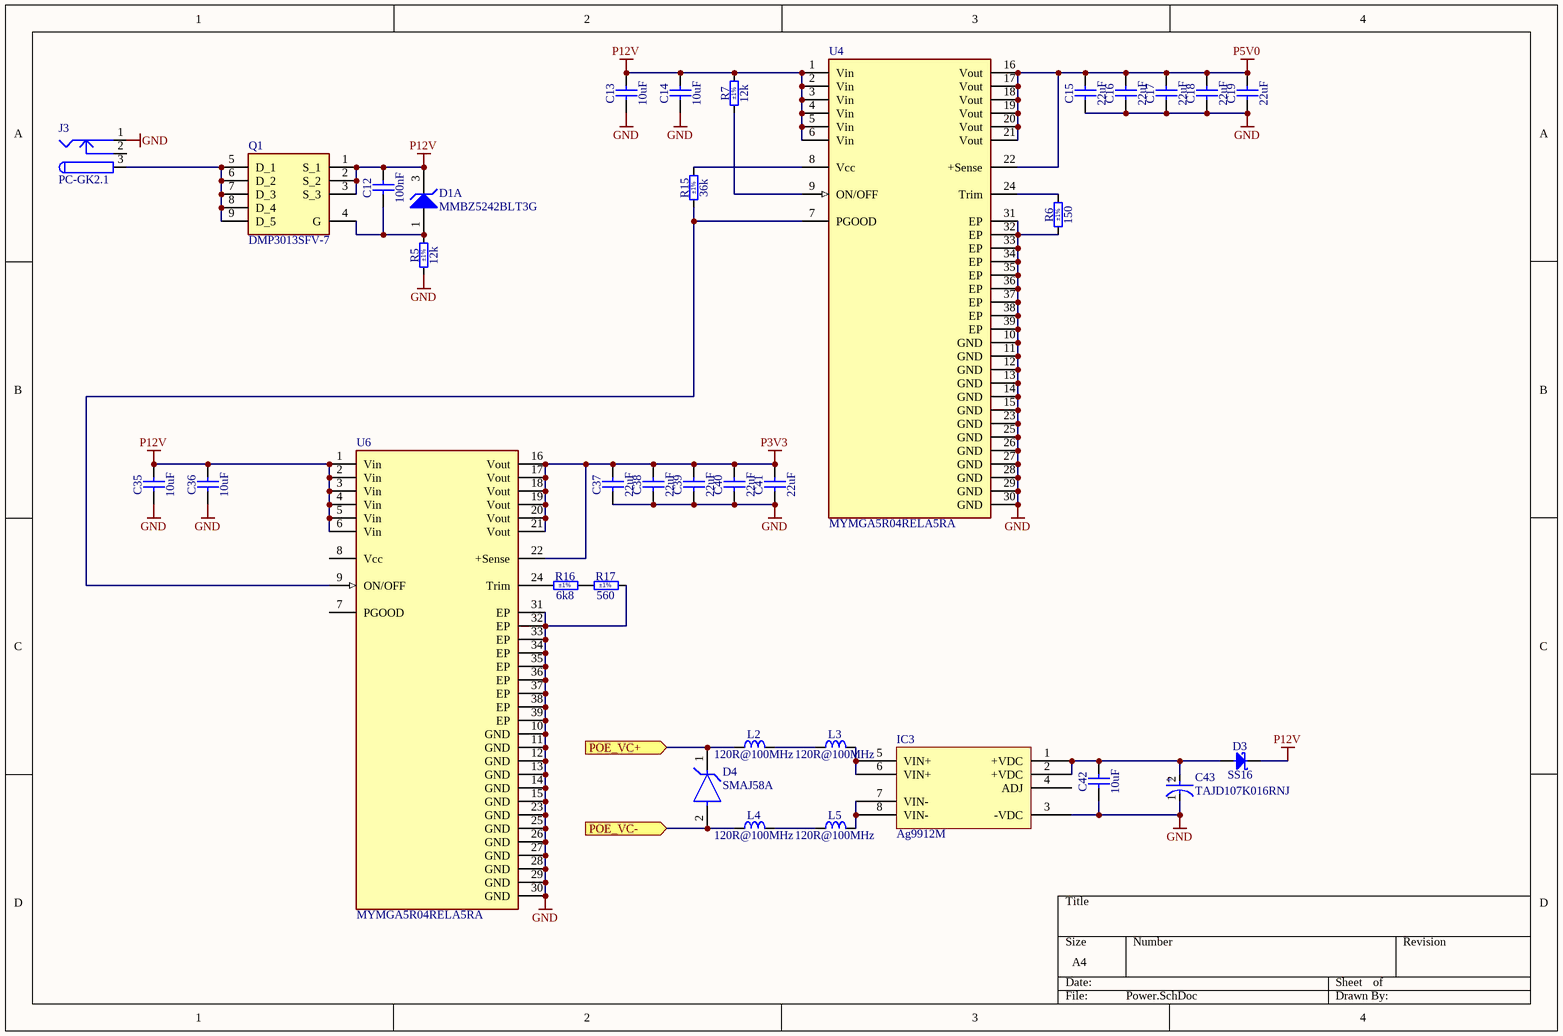
[diagram p3: Power.SchDoc]

### Parts
(Parts that share a designator on the sheet are numbered #1, #2 ... from top to bottom, then left to right.)
C12  100nF  [CAPC1005X55N]
C13  10uF  [CAPC2012X95N]
C14  10uF  [CAPC2012X95N]
C15  22uF  [CAPC2012X135N]
C16  22uF  [CAPC2012X135N]
C17  22uF  [CAPC2012X135N]
C18  22uF  [CAPC2012X135N]
C19  22uF  [CAPC2012X135N]
C35  10uF  [CAPC2012X95N]
C36  10uF  [CAPC2012X95N]
C37  22uF  [CAPC2012X135N]
C38  22uF  [CAPC2012X135N]
C39  22uF  [CAPC2012X135N]
C40  22uF  [CAPC2012X135N]
C41  22uF  [CAPC2012X135N]
C42  10uF  [CAPC2012X95N]
C43  TAJD107K016RNJ  [FP-TAJD-MFG]
D1  MMBZ5242BLT3G  [ONSC-SOT-23-3-318-08_V]  (part A of 2)
D3#1  SS16  [DIOM5127X229N]
D4#1  SMAJ58A  [FP-SMAJ-MFG]
IC3  Ag9912M  [Ag9900M]
J3  PC-GK2.1  [DC2020]
L2  120R@100MHz  [INDC1608X65N]
L3  120R@100MHz  [INDC1608X65N]
L4  120R@100MHz  [INDC1608X65N]
L5  120R@100MHz  [INDC1608X65N]
Q1  DMP3013SFV-7  [DMP3013SFV7]
R5  12k  Tolerance: ±1%  [RESC1005X40N]
R6  150  Tolerance: ±1%  [RESC1005X40N]
R7  12k  Tolerance: ±1%  [RESC1005X40N]
R15  36k  Tolerance: ±1%  [RESC1005X40N]
R16  6k8  Tolerance: ±1%  [RESC1005X40N]
R17  560  Tolerance: ±1%  [RESC1005X40N]
U4  MYMGA5R04RELA5RA  [FP-MYMGA-MFG]
U6  MYMGA5R04RELA5RA  [FP-MYMGA-MFG]

### Ports
POE_VC+ (in), POE_VC- (in)

### Nets
GND: C13.1 C14.1 C15.1 C16.1 C17.1 C18.1 C19.1 C35.1 C36.1 C37.1 C38.1 C39.1 C40.1 C41.1 C42.1 C43.1(C) IC3.3(-VDC) J3.1 R5.1 R6.1 R17.2 U4.10(GND) U4.11(GND) U4.12(GND) U4.13(GND) U4.14(GND) U4.15(GND) U4.23(GND) U4.25(GND) U4.26(GND) U4.27(GND) U4.28(GND) U4.29(GND) U4.30(GND) U4.31(EP) U4.32(EP) U4.33(EP) U4.34(EP) U4.35(EP) U4.36(EP) U4.37(EP) U4.38(EP) U4.39(EP) U6.10(GND) U6.11(GND) U6.12(GND) U6.13(GND) U6.14(GND) U6.15(GND) U6.23(GND) U6.25(GND) U6.26(GND) U6.27(GND) U6.28(GND) U6.29(GND) U6.30(GND) U6.31(EP) U6.32(EP) U6.33(EP) U6.34(EP) U6.35(EP) U6.36(EP) U6.37(EP) U6.38(EP) U6.39(EP)
P3V3: C37.2 C38.2 C39.2 C40.2 C41.2 U6.16(Vout) U6.17(Vout) U6.18(Vout) U6.19(Vout) U6.20(Vout) U6.21(Vout) U6.22(+Sense)
P5V0: C15.2 C16.2 C17.2 C18.2 C19.2 U4.16(Vout) U4.17(Vout) U4.18(Vout) U4.19(Vout) U4.20(Vout) U4.21(Vout) U4.22(+Sense)
P12V: C12.2 C13.2 C14.2 C35.2 C36.2 D1.3(K) D3#1.1(C) Q1.1(S_1) Q1.2(S_2) Q1.3(S_3) R7.2 U4.1(Vin) U4.2(Vin) U4.3(Vin) U4.4(Vin) U4.5(Vin) U4.6(Vin) U6.1(Vin) U6.2(Vin) U6.3(Vin) U6.4(Vin) U6.5(Vin) U6.6(Vin)
NetC12_1: C12.1 D1.1(A) Q1.4(G) R5.2
NetC42_2: C42.2 C43.2(A) D3#1.2(A) IC3.1(+VDC) IC3.2(+VDC)
NetD3#2_3: D4#1.1(C) L2.1 ; port POE_VC+
NetD3#2_4: D4#1.2(A) L4.1 ; port POE_VC-
NetIC3_5: IC3.5(VIN+) IC3.6(VIN+) L3.2
NetIC3_7: IC3.7(VIN-) IC3.8(VIN-) L5.2
NetJ3_3: J3.3 Q1.5(D_1) Q1.6(D_2) Q1.7(D_3) Q1.8(D_4) Q1.9(D_5)
NetL2_2: L2.2 L3.1
NetL4_2: L4.2 L5.1
NetR6_2: R6.2 U4.24(Trim)
NetR7_1: R7.1 U4.9(ON/OFF)
NetR15_1: R15.1 U4.7(PGOOD) U6.9(ON/OFF)
NetR15_2: R15.2 U4.8(Vcc)
NetR16_1: R16.1 U6.24(Trim)
NetR16_2: R16.2 R17.1

Not connected (* = marked no-connect by the designer): IC3 4(ADJ); J3 2; U6 7(PGOOD) 8(Vcc)

### Notes on the sheet
- (in symbol CMP-2000-05064-2) +

### Library data of the parts
C12 = CC0402_100NF_16V_10%_X5R: Non-polarised capacitor; Manufacturer: GENERIC; Part Description: SMD Multilayer Chip Ceramic Capacitor; Manufacturer1 Part Number: GRM155R61C104KA88D; Tolerance: ±10%; Voltage: 16V; TC: X5R; Manufacturer Part Number: CC0402_100NF_16V_10%_X5R; Part Number: CC0402_100NF_16V_10%_X5R; Value: 100nF; Component Kind: Standard; Component Type: Standard; Pin Count: 2; Status: None; Case: 0402; Mounted: Yes; Socket: No; SMD: Yes; Sense: No; Manufacturer1 Example: MURATA; Manufacturer1 ComponentHeight: 0.55mm; HelpURL: \\cern.ch\dfs\Applications\Altium\Datasheets\CC0402_X5R_MURATA_GRM.pdf; Author: CERN DEM JLC; CreateDate: 10.12.2013; LatestRevisionDate: 10.12.2013
C13 C14 C35 C36 C42 = CC0805_10UF_25V_10%_X5R: as C4 on sheet M.2_NVME; Part Number: CC0805_10UF_25V_10%_X5R; Component Kind: Standard; Component Type: Standard; Pin Count: 2; Value: 10uF; Status: Preferred; Manufacturer Part Number: CC0805_10UF_25V_10%_X5R; Case: 0805; Mounted: Yes; Socket: No; SMD: Yes; Sense: No; Manufacturer1 Example: MURATA; Manufacturer1 ComponentHeight: 0.95mm; HelpURL: \\cern.ch\dfs\Applications\Altium\Datasheets\CC0805_X5R_MURATA_GRM.pdf; Author: CERN DEM JLC; CreateDate: 25.10.2012; LatestRevisionDate: 06.09.2016
C15-C19 C37-C41 = CC0805_22UF_10V_+80%-20%_Y5V: Non-polarised capacitor; Part Description: SMD Multilayer Chip Ceramic Capacitor; Manufacturer: GENERIC; Manufacturer1 Part Number: 2222 241 19881; Voltage: 10V; TC: Y5V; Part Number: CC0805_22UF_10V_+80%-20%_Y5V; Component Kind: Standard; Component Type: Standard; Pin Count: 2; Value: 22uF; Status: Preferred; Tolerance: +80% -20%; Manufacturer Part Number: CC0805_22UF_10V_+80%-20%_Y5V; Case: 0805; Mounted: Yes; Socket: No; SMD: Yes; Sense: No; Manufacturer1 Example: PHYCOMP; Manufacturer1 ComponentHeight: 1.45mm; HelpURL: \\cern.ch\dfs\Applications\Altium\Datasheets\CC0805_Y5V_PHYCOMP.pdf; Author: CERN DEM JLC; CreateDate: 03.12.2007; LatestRevisionDate: 03.12.2007
C43 = CMP-2000-05064-2: 100uF 16V  ±10% 600mΩ 2917  SMD Tantalum Capacitor; Dissipation Factor: 6%; Polarity: Polar; Leakage Current: 16uA; ESR (Equivalent Series Resistance): 600mR; Depth: 4.3mm; Series: TAJ; Case Code (Metric): 7343; Min Operating Temperature: -55°C; Packaging: Tape and Reel; Termination: SMD/SMT; Voltage Rating (DC): 16V; Case/Package: 2917; Number of Pins: 2; Width: 4.3mm; Mount: Surface Mount; Tolerance: 10%; Voltage: 16V; Radiation Hardening: No; Lead Free: Lead Free; Capacitance: 100uF; Height: 2.9mm; RoHS Compliant: Yes; Max Operating Temperature: 125°C; Construction: Flat; Height - Seated (Max): 0.122inch; Case Code (Imperial): 2917; Package Quantity: 1; Dielectric Material: Tantalum; REACH SVHC: No SVHC; Features: General Purpose; Voltage Rating: 16V; Length: 7.3mm
D1 = CMP-1060-01195-1: Zener Voltage Regulator, 225 mW, 3-Pin SOT-23, Pb-Free, Tape and Reel; Manufacturer: On Semiconductor; VZ Typ (V): 12; PackageReference: SOT-23-3-318-08; RoHS: Pb-Free; PartNumber: MMBZ5242BLT3G; ComponentLink1Description: Manufacturer URL; ComponentLink3Description: Package Specification; ComponentLink3URL: http://www.onsemi.cn/pub_link/Collateral/318-08.PDF; PackageVersion: Rev. AP, 11/2009; ComponentLink1URL: http://www.onsemi.com/; Packing: Tape and Reel; ComponentLink2URL: http://www.onsemi.cn/pub_link/Collateral/MMBZ5221BLT1-D.PDF; PackageDescription: 3-Pin Small Outline Transistor, Body 2.92 x 1.3 mm, Pitch 0.95 mm; DatasheetVersion: Rev. 12; ComponentLink2Description: Datasheet; Mounting Technology: Surface Mount
D3#1 = SS16: Schottky Diode; Part Description: Surface Mount Schottky Barrier Rectifier; Manufacturer: VISHAY GENERAL SEMICONDUCTOR; Voltage: 60V; Power: 1A; PressFit: No; Bonding: No; Part Number: SS16; Component Kind: Standard; Component Type: Standard; Device: SS16; PackageDescription: DO-214-AC Molded Diode, Body 5.1x2.7mm, IPC Medium Density; Manufacturer Part Number: SS16; Pin Count: 2; Case: DO-214AC; Mounted: Yes; Socket: No; SMD: Yes; Sense: No; ComponentHeight: 2.29mm; HelpURL: \\cern.ch\dfs\Applications\Altium\Datasheets\SS16.pdf; Author: CERN DEM JLC; CreateDate: 15.07.2008; LatestRevisionDate: 23.08.2010
D4#1 = CMP-07401-000004-1: TVS DIODE 58V 93.6V SMA; Manufacturer: Bourns Inc.; Max Junction Temp: +150°C; Breakdown Voltage: 64.4V; Number Of Channels: 1; Peak Pulse Power: 400W; Peak Pulse Current: 4.3A; Direction: Unidirectional; Temperature Range High: +150°C; Clamping Voltage: 93.6V; Package: SMAJ; ComponentLink2Description: Datasheet; Temperature Range Low: -55°C; Mouser Description: TVS Diodes - Transient Voltage Suppressors 58volts 5uA 4.3 Amps Uni-Dir; Category: Diode; ComponentLink2URL: https://www.bourns.com/docs/Product-Datasheets/SMAJ.pdf; Temperature: -55°C to +150°C; Device Class L3: unset; Automotive: No; Device Class L2: TVS Diodes; Digikey Description: TVS DIODE 58V 93.6V SMA; Lead Free: Yes; Octopart: https://octopart.com/smaj58a-bourns-12809395; Device Class L1: Circuit Protection; Manufacturer Part Number: SMAJ58A; Reverse Standoff Voltage: 58V; Height: 2.29mm; RoHS: TRUE
IC3 = Ag9900M
J3 = CON_DC_JACK_TH: Low Voltage Power Supply Connector (maritex); Published: 17-Dec-2003; Datasheet: Latest Revision: 09-May-2002; Publisher: Altium Limited; Supplier 1: TME; Supplier Part Number 1: PC-GK2.1
L2-L5 = IND0603_MURATA_BLM18SG121TN1D: Inductor; Part Description: SMD EMIFIL Suppression Chip Ferrite Bead; Manufacturer: MURATA; Power: 3A; Resistance: 0.025R; Tolerance: ±25%; Table: Inductors SMD; Part Number: IND0603_MURATA_BLM18SG121TN1D; Component Kind: Standard; Component Type: Standard; Pin Count: 2; Value: 120R@100MHz; Status: None; Manufacturer Part Number: BLM18SG121TN1D; Case: 0603; Mounted: Yes; Socket: No; SMD: Yes; ComponentHeight: 0.65mm; HelpURL: \\cern.ch\dfs\Applications\Altium\Datasheets\IND0603_MURATA_BLM18S.pdf; Author: CERN DEM JLC; CreateDate: 2014-07-23; LatestRevisionDate: 2014-07-23
Q1 = DMP3013SFV-7: MOSFET (P-Channel); Manufacturer_Name: Diodes Inc.; Datasheet Link: https://4donline.ihs.com/images/VipMasterIC/IC/DIOD/DIOD-S-A0008513542/DIOD-S-A0008513542-1.pdf?hkey=52A5661711E402568146F3353EA87419; Height: 0.85mm; Manufacturer_Part_Number: DMP3013SFV-7
R5 R7 = R0402_12K_1%_0.0625W_100PPM: Resistor - 1%; Part Description: General Purpose Thick Film Chip Resistor; Manufacturer: GENERIC; Manufacturer1 Part Number: 232270671203L; TC: ±100ppm/°C; PressFit: No; Part Number: R0402_12K_1%_0.0625W_100PPM; Component Kind: Standard; Component Type: Standard; Pin Count: 2; Value: 12k; Status: Not Recommended; Power: 0.0625W; Manufacturer Part Number: R0402_12K_1%_0.0625W_100PPM; Case: 0402; Mounted: Yes; Sense: No; Socket: No; SMD: Yes; Manufacturer1 Example: YAGEO PHYCOMP; Manufacturer1 ComponentHeight: 0.4mm; HelpURL: \\cern.ch\dfs\Applications\Altium\Datasheets\R0402_Phycomp_RC0402.pdf; Author: CERN DEM JLC; CreateDate: 03.12.2007; LatestRevisionDate: 17.10.2012
R6 = R0402_150R_1%_0.0625W_100PPM: Resistor - 1%; Part Description: General Purpose Thick Film Chip Resistor; Manufacturer: GENERIC; Manufacturer1 Part Number: 232270671501L; TC: ±100ppm/°C; PressFit: No; Part Number: R0402_150R_1%_0.0625W_100PPM; Component Kind: Standard; Component Type: Standard; Pin Count: 2; Value: 150; Status: Not Recommended; Power: 0.0625W; Manufacturer Part Number: R0402_150R_1%_0.0625W_100PPM; Case: 0402; Mounted: Yes; Sense: No; Socket: No; SMD: Yes; Manufacturer1 Example: YAGEO PHYCOMP; Manufacturer1 ComponentHeight: 0.4mm; HelpURL: \\cern.ch\dfs\Applications\Altium\Datasheets\R0402_Phycomp_RC0402.pdf; Author: CERN DEM JLC; CreateDate: 03.12.2007; LatestRevisionDate: 17.10.2012
R15 = R0402_36K_1%_0.0625W_100PPM: Resistor - 1%; Part Description: General Purpose Thick Film Chip Resistor; Manufacturer: GENERIC; Manufacturer1 Part Number: 232270673603L; TC: ±100ppm/°C; PressFit: No; Part Number: R0402_36K_1%_0.0625W_100PPM; Component Kind: Standard; Component Type: Standard; Pin Count: 2; Value: 36k; Status: Not Recommended; Power: 0.0625W; Manufacturer Part Number: R0402_36K_1%_0.0625W_100PPM; Case: 0402; Mounted: Yes; Sense: No; Socket: No; SMD: Yes; Manufacturer1 Example: YAGEO PHYCOMP; Manufacturer1 ComponentHeight: 0.4mm; HelpURL: \\cern.ch\dfs\Applications\Altium\Datasheets\R0402_Phycomp_RC0402.pdf; Author: CERN DEM JLC; CreateDate: 03.12.2007; LatestRevisionDate: 17.10.2012
R16 = R0402_6K8_1%_0.0625W_100PPM: Resistor - 1%; Part Description: General Purpose Thick Film Chip Resistor; Manufacturer: GENERIC; Manufacturer1 Part Number: 232270676802L; TC: ±100ppm/°C; PressFit: No; Part Number: R0402_6K8_1%_0.0625W_100PPM; Component Kind: Standard; Component Type: Standard; Pin Count: 2; Value: 6k8; Status: Not Recommended; Power: 0.0625W; Manufacturer Part Number: R0402_6K8_1%_0.0625W_100PPM; Case: 0402; Mounted: Yes; Sense: No; Socket: No; SMD: Yes; Manufacturer1 Example: YAGEO PHYCOMP; Manufacturer1 ComponentHeight: 0.4mm; HelpURL: \\cern.ch\dfs\Applications\Altium\Datasheets\R0402_Phycomp_RC0402.pdf; Author: CERN DEM JLC; CreateDate: 03.12.2007; LatestRevisionDate: 17.10.2012
R17 = R0402_560R_1%_0.0625W_100PPM: Resistor - 1%; Part Description: General Purpose Thick Film Chip Resistor; Manufacturer: GENERIC; Manufacturer1 Part Number: 232270675601L; TC: ±100ppm/°C; PressFit: No; Part Number: R0402_560R_1%_0.0625W_100PPM; Component Kind: Standard; Component Type: Standard; Pin Count: 2; Value: 560; Status: Not Recommended; Power: 0.0625W; Manufacturer Part Number: R0402_560R_1%_0.0625W_100PPM; Case: 0402; Mounted: Yes; Sense: No; Socket: No; SMD: Yes; Manufacturer1 Example: YAGEO PHYCOMP; Manufacturer1 ComponentHeight: 0.4mm; HelpURL: \\cern.ch\dfs\Applications\Altium\Datasheets\R0402_Phycomp_RC0402.pdf; Author: CERN DEM JLC; CreateDate: 03.12.2007; LatestRevisionDate: 17.10.2012
U4 U6 = CMP-20596-000031-1: DC DC CONVERTER 3.3-5V 20W; RoHS Compliant: Yes

## Sheet Ethernet.SchDoc
size A4; SheetNumber: 5; SheetTotal: 10
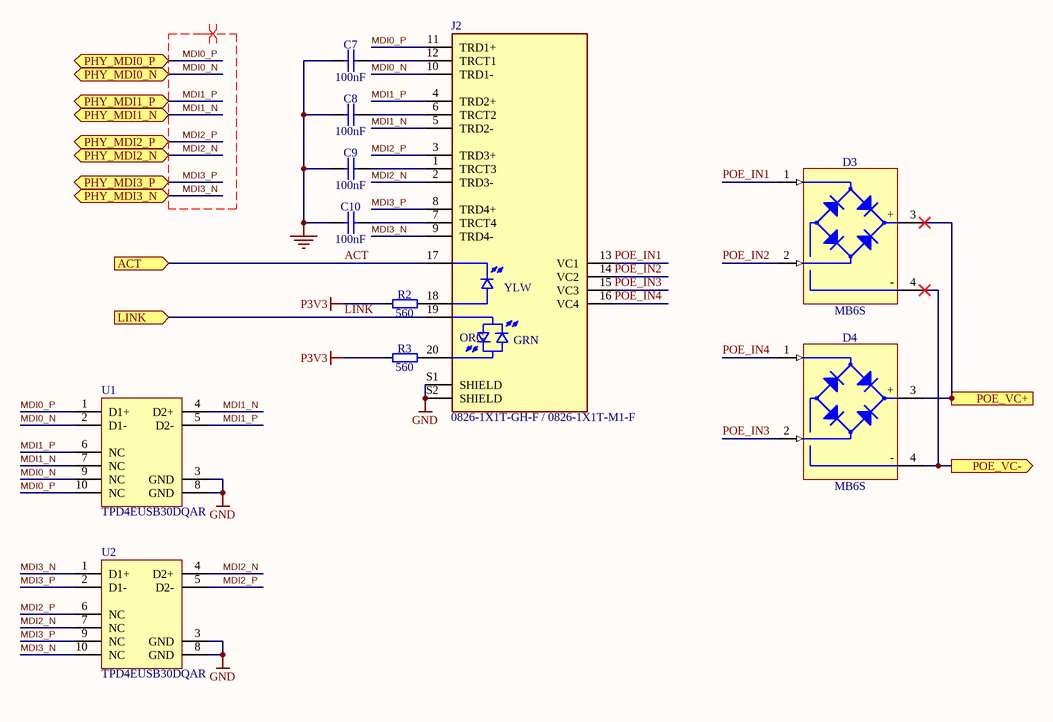
[diagram p4: Ethernet.SchDoc]

### Parts
(Parts that share a designator on the sheet are numbered #1, #2 ... from top to bottom, then left to right.)
C7  100nF  [CAPC1005X55N]
C8  100nF  [CAPC1005X55N]
C9  100nF  [CAPC1005X55N]
C10  100nF  [CAPC1005X55N]
D3#2  MB6S  [SOIC254P665X290-4N]
D4#2  MB6S  [SOIC254P665X290-4N]
J2  0826-1X1T-GH-F / 0826-1X1T-M1-F  [BEL_0826-1X1T-GH-F]
R2  560  [RESC1005X40N]
R3  560  [RESC1005X40N]
U1  TPD4EUSB30DQAR  [DQA0010A_V]
U2  TPD4EUSB30DQAR  [DQA0010A_V]

### Ports
ACT (in), LINK (in), PHY_MDI0_N (bidir), PHY_MDI0_P (bidir), PHY_MDI1_N (bidir), PHY_MDI1_P (bidir), PHY_MDI2_N (bidir), PHY_MDI2_P (bidir), PHY_MDI3_N (bidir), PHY_MDI3_P (bidir), POE_VC+ (out), POE_VC- (out)

### Nets
GND: C7.1 C8.1 C9.1 C10.1 J2.S1(SHIELD) J2.S2(SHIELD) U1.3(GND) U1.8(GND) U2.3(GND) U2.8(GND)
P3V3: R2.1 R3.1
ACT: J2.17 ; port ACT
LINK: J2.19 ; port LINK
MDI0_N: J2.10(TRD1-) U1.2(D1-) U1.9(NC) ; port PHY_MDI0_N
MDI0_P: J2.11(TRD1+) U1.1(D1+) U1.10(NC) ; port PHY_MDI0_P
MDI1_N: J2.5(TRD2-) U1.4(D2+) U1.7(NC) ; port PHY_MDI1_N
MDI1_P: J2.4(TRD2+) U1.5(D2-) U1.6(NC) ; port PHY_MDI1_P
MDI2_N: J2.2(TRD3-) U2.4(D2+) U2.7(NC) ; port PHY_MDI2_N
MDI2_P: J2.3(TRD3+) U2.5(D2-) U2.6(NC) ; port PHY_MDI2_P
MDI3_N: J2.9(TRD4-) U2.1(D1+) U2.10(NC) ; port PHY_MDI3_N
MDI3_P: J2.8(TRD4+) U2.2(D1-) U2.9(NC) ; port PHY_MDI3_P
POE_IN1: D3#2.1(AC) J2.13(VC1)
POE_IN2: D3#2.2(AC) J2.14(VC2)
POE_IN3: D4#2.2(AC) J2.15(VC3)
POE_IN4: D4#2.1(AC) J2.16(VC4)
NetC7_2: C7.2 J2.12(TRCT1)
NetC8_2: C8.2 J2.6(TRCT2)
NetC9_2: C9.2 J2.1(TRCT3)
NetC10_2: C10.2 J2.7(TRCT4)
NetD3#2_3: D3#2.3(+) D4#2.3(+) ; port POE_VC+
NetD3#2_4: D3#2.4(-) D4#2.4(-) ; port POE_VC-
NetJ2_18: J2.18 R2.2
NetJ2_20: J2.20 R3.2

### Layout directives
differential pair: MDI0_N, MDI0_P, MDI1_N, MDI1_P, MDI2_N, MDI2_P, MDI3_N, MDI3_P

### Notes on the sheet
- (in symbol 0826-1X1T-GH-F) YLW; ORG; GRN

### Library data of the parts
C7-C10 = CC0402_100NF_16V_10%_X5R: as C12 on sheet Power; Manufacturer Part Number: CC0402_100NF_16V_10%_X5R; Part Number: CC0402_100NF_16V_10%_X5R; Value: 100nF; Component Kind: Standard; Component Type: Standard; Pin Count: 2; Status: None; Case: 0402; Mounted: Yes; Socket: No; SMD: Yes; Sense: No; Manufacturer1 Example: MURATA; Manufacturer1 ComponentHeight: 0.55mm; HelpURL: \\cern.ch\dfs\Applications\Altium\Datasheets\CC0402_X5R_MURATA_GRM.pdf; Author: CERN DEM JLC; CreateDate: 10.12.2013; LatestRevisionDate: 10.12.2013
D3#2 D4#2 = MB6S: Bridge Rectifier 1AC 2AC 3+ 4-; Part Description: Miniature Glass Passivated Fast Recovery Surface Mount Bridge Rectifier; Manufacturer: VISHAY GENERAL SEMICONDUCTOR; Voltage: 600V; Power: 0.5A; PressFit: No; Bonding: No; Part Number: MB6S; Component Kind: Standard; Component Type: Standard; Device: MB6S; PackageDescription: SOIC, 4-Leads, Body 3.9x4.75mm, Pitch 2.54mm, IPC Medium Density; Manufacturer Part Number: MB6S; Pin Count: 4; Case: SOIC4; Mounted: Yes; Socket: No; SMD: Yes; Sense: No; ComponentHeight: 2.9mm; HelpURL: \\cern.ch\dfs\Applications\Altium\Datasheets\MB6S.pdf; Author: CERN DEM MR; CreateDate: 15.04.2016; LatestRevisionDate: 15.04.2016
J2 = 0826-1X1T-GH-F: MagJack 1000BASE-T | PoE+ | 1X1 | OG/Y | -40 to 85C | Tab Up | RoHS; MF: Bel Magnetic Solutions; Value: *; Availability: Unavailable; Package: None; Price: None; SnapEDA_Link: https://www.snapeda.com/parts/0826-1X1T-GH-F/Bel%20Magnetic%20Solutions/view-part/417678/?ref=snap; MP: 0826-1X1T-GH-F
R2 R3 = R0402_560R_1%_0.0625W_100PPM: as R17 on sheet Power; Part Number: R0402_560R_1%_0.0625W_100PPM; Component Kind: Standard; Component Type: Standard; Pin Count: 2; Value: 560; Status: Not Recommended; Power: 0.0625W; Tolerance: ±1%; Manufacturer Part Number: R0402_560R_1%_0.0625W_100PPM; Case: 0402; Mounted: Yes; Sense: No; Socket: No; SMD: Yes; Manufacturer1 Example: YAGEO PHYCOMP; Manufacturer1 ComponentHeight: 0.4mm; HelpURL: \\cern.ch\dfs\Applications\Altium\Datasheets\R0402_Phycomp_RC0402.pdf; Author: CERN DEM JLC; CreateDate: 03.12.2007; LatestRevisionDate: 17.10.2012
U1 U2 = CMP-0326-00027-3: ESD Solution for Super-Speed (6 GBPS) USB 3.0 Interface, 4 Channels, -40 to +85 degC, 10-pin SON (DQA), Green (RoHS & no Sb/Br); Manufacturer: Texas Instruments; Differential Capacitance(pF): 0.05; Serial ATA / eSATA: TRUE; IO Capacitance(Typ)(pF): 0.8; IO Leakage Current(nA): 10; IEC 61000-4-2 Air-Gap(+/- kV): 8; ComponentLink3Description: URL Link1; PartNumber: TPD4EUSB30DQAR; DatasheetVersion: SLVSAC2C; ComponentLink2URL: http://www.ti.com/general/docs/lit/getliterature.tsp?genericPartNumber=TPD4EUSB30&fileType=pdf; USB Super Speed: TRUE; Eco-Plan: Green (RoHS & no Sb/Br); Mounting Technology: Surface Mount; 1394 / Firewire: TRUE; PackageVersion: revB, Sep-2009; SubFamily: ESD Solution; USB Full Speed: TRUE; USB High Speed: TRUE; ComponentLink2Description: Datasheet; ComponentLink1URL: http://www.ti.com/; IEC 61000-4-2 Contact(+/- kV): 8; Breakdown Voltage(Min)(V): 8; PackageReference: DQA0010A; ComponentLink1Description: Manufacturer URL; PackageDescription: 10-Pin Plastic Small Outline No-Lead, 1 x 2.5 x 0.55 mm Body, 0.5 mm Pitch; ComponentLink3URL: SamplesURL:http://www.ti.com/product/tpd4eusb30#samples; HDMI: TRUE